# Altium project 1LED+CR12xx_TESTBOARD.PrjPCB
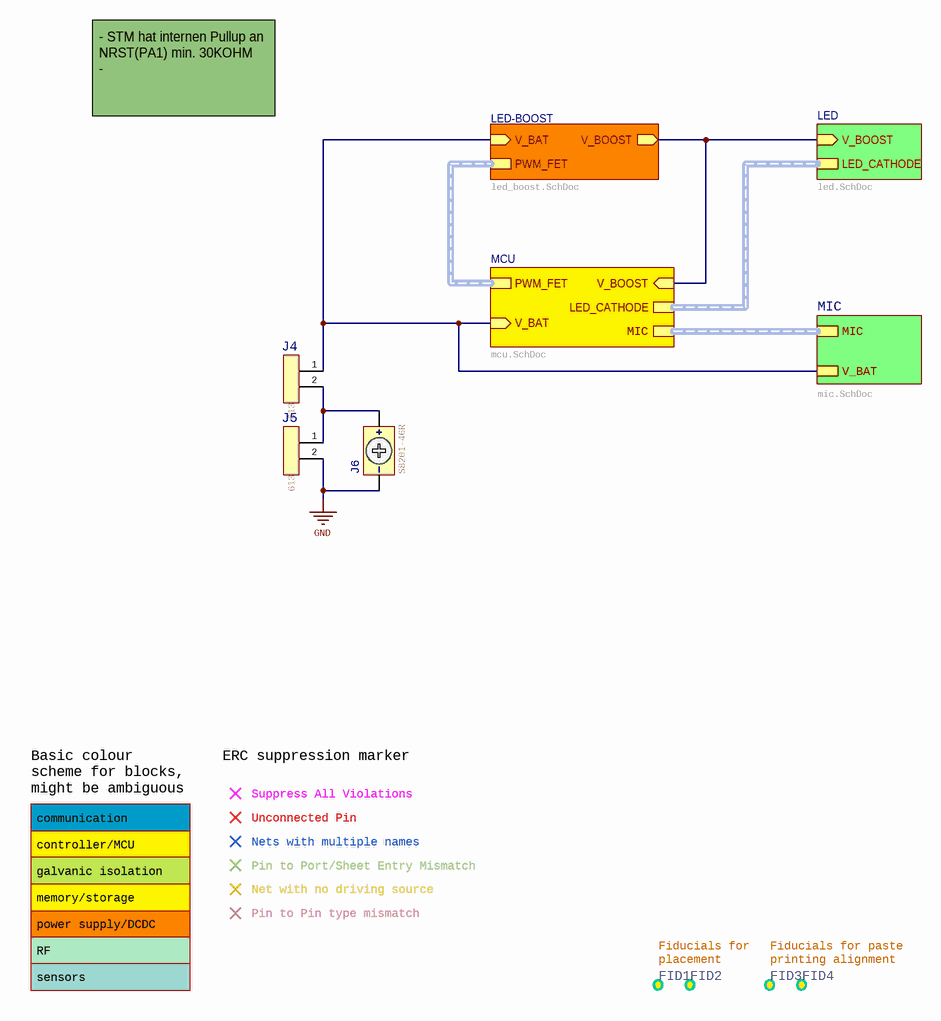
[diagram p0: main.SchDoc]
PCBCopperIL: Set required copper thickness inner layers; PCBCopperOL: Set required copper thickness outer layers; PCBFinish: Set required finished; PCBHoleSize: Set min finished hole size; PCBIsolationIL: Set min isolation IL; PCBIsolationOL: Set min isolation OL; PCBMaterial: FR4; PCBMinIAR: Set min IAR; PCBMinOAR: Set min OAR; PCBNumLayers: Set # of layers; PCBSeparation: Set separation methof (Breakrouting/V-cut); PCBThickness: Set final PCB thickness; PCBTrackWidthIL: Set min track width IL; PCBTrackWidthOL: Set min track width OL; ProjectCustomer: Set ProjectCustomer in Project Options; ProjectPart: Set ProjectPart in Project Options; ProjectTitle: Set ProjectTitle in Project Options
5 sheets, 52 parts. Net scope: hierarchical (ports join the sheet entries above them; power ports are global).
Board files: 1RGB-LED-Board_CR12xx-TESTBOARD.PcbDoc, 1RGB-LED-Board_CR12xx_TestPanel.PcbDoc
Sheets:
  main.SchDoc
    MCU = mcu.SchDoc
    LED = led.SchDoc
    LED-BOOST = led_boost.SchDoc
    MIC = mic.SchDoc

## Sheet main.SchDoc
size 297 x 209 mm; ProjectSection: Set ProjectSection in Document Parameters; PageSetup: Record=PageOptions|CenterHorizontal=True|CenterVertical=True|PrintScale=1.00|XCorrection=1.00|YCorrection=1.00|PrintKind=1|BorderSize=5000000|LeftOffset=0|BottomOffset=0|Orientation=2|PaperLength=1000|PaperWidth=1000|Scale=100|PaperSource=7|PrintQuality=1200|MediaType=1|DitherType=10|PaperKind=A4|PrintScaleMode=1

### Parts
FID1  FIDUCIAL  [FID-1MM-0.5MM]  (value not drawn)  (no BOM)
FID2  FIDUCIAL  [FID-1MM-0.5MM]  (value not drawn)  (no BOM)
FID3  FIDUCIAL-CIRCLE-PASTE  [FID-1MM-0.5MM-PASTE]  (value not drawn)  (no BOM)
FID4  FIDUCIAL-CIRCLE-PASTE  [FID-1MM-0.5MM-PASTE]  (value not drawn)  (no BOM)
J4  Manufacturer P/N: 61300211121  [CON-02-1-254-V-T-PFL-Jumper]  (hidden comment: CON-02)
J5  Manufacturer P/N: 61300211121  [CON-02-1-254-V-T-PFL-Jumper]  (hidden comment: CON-02)
J6  Manufacturer P/N: S8201-46R  [BAT-CR1225-SMD-HARWIN]  (hidden comment: BAT-COIN)

### Sub-sheets
LED = led.SchDoc: V_BOOST (in), LED_CATHODE (harness LED_CATHODE)
LED-BOOST = led_boost.SchDoc: PWM_FET (harness PWM_FET), V_BAT (in), V_BOOST (out)
MCU = mcu.SchDoc: V_BAT (in), LED_CATHODE (harness LED_CATHODE), PWM_FET (harness PWM_FET), V_BOOST (in), MIC (harness MIC)
MIC = mic.SchDoc: MIC (harness MIC), V_BAT

### Nets
GND: J5.2 J6.2(-)
V_BAT: J4.1 ; sheet MCU/V_BAT, sheet LED-BOOST/V_BAT, sheet MIC/V_BAT
V_BOOST: sheet MCU/V_BOOST, sheet LED/V_BOOST, sheet LED-BOOST/V_BOOST
NetJ4_2: J4.2 J5.1 J6.1(+)

### Buses and harness runs
harness sheet LED-BOOST/PWM_FET = sheet MCU/PWM_FET
harness sheet LED/LED_CATHODE = sheet MCU/LED_CATHODE
harness sheet MCU/MIC = sheet MIC/MIC

### Notes on the sheet
- - STM hat internen Pullup an NRST(PA1) min. 30KOHM
  -
- Suppress All Violations
- communication
- controller/MCU
- Unconnected Pin
- Nets with multiple names
- Pin to Port/Sheet Entry Mismatch
- power supply/DCDC
- memory/storage
- galvanic isolation
- Net with no driving source
- Pin to Pin type mismatch
- Basic colour scheme for blocks, might be ambiguous
- RF
- sensors
- ERC suppression marker
- Fiducials for
  placement
- Fiducials for paste
  printing alignment
- PCB production parameters
- # of layers:
- material:
- copper thickness (µm)
- outer layers:
- hole parameters (µm)
- final pcb thickness (mm):
- min finished hole size:
- separation method:
- surface finish:
- min track width outer layers (µm):
- min track width inner layers (µm):
- Project
- inner layers:
- Customer
- min outer annular ring:
- min inner annular ring:
- isolation distance outer layers (µm):
- isolation distance inner layers (µm):
- File Name
- Part
- Section
- Revision (File)
- Variant
- Revision (Project)
- Date
- Sheet
- Contronix GmbH <https://contronix.de>
- Nizzastr. 6, 01445 Radebeul

### Library data of the parts
FID1 FID2 = FID-1MM-0.5MM: Fiducial Mark, 1mm diameter, 0.5mm clearance; hasAltManufacturer: 0; Contronix P/N: W2HGX5; Design Item Id: FID-1MM-0.5MM; Created: 28.03.2011 09:53:08; Modified: 14.03.2013 14:16:18; Obsolete: 0
FID3 FID4 = FID-1MM-0.5MM-CIRCLE-PASTE: Fiducial Mark, 1mm circle0.5mm clearance, Pastemask open; hasAltManufacturer: 0; Contronix P/N: M7DEYG; Design Item Id: FID-1MM-0.5MM-CIRCLE-PASTE; Created: 27.10.2017 07:53:13; Modified: 27.10.2017 07:53:13; Obsolete: 0
J4 J5 = CON-02-1-254-V-T-PFL-Jumper: Stiftleiste, 2-polig, 2.54mm, +Jumper; Manufacturer: Würth Elektronik; hasAltManufacturer: 0; Contronix P/N: JT919C; NumberOfPins: 2; NumberOfRows: 1; Pitch: 2,54; Rev: =VersionControl_RevNumber; Design Item Id: CON-02-1-254-V-T-PFL-Jumper; Manufacturer Part Number: 61300211121; Stock: 0; Price: 0,05; Price (€): 0,05; autIdem: 0; A I: 0; ComponentLink1Description: Manufacturer Datasheet; ComponentLink1URL: http://www.molex.com/datasheets/pdf/0879140216_PCB_HEADERS.pdf; Supplier 1: Digi-Key; Supplier Part Number 1: 732-5315-ND; Supplier 2: Mouser; Supplier Part Number 2: 710-61300211121; Modified: 25.07.2019 11:36:41; Obsolete: 0; MountingType: THT
J6 = BAT-CR1225-SMD-HARWIN: CR1216 1225 Battery Holder SMT; Manufacturer: Harwin; hasAltManufacturer: 0; Contronix P/N: JWVM9H; NumberOfPins: 2; NumberOfRows: 1; Rev: =VersionControl_RevNumber; Design Item Id: BAT-CR1225-SMD-HARWIN; Price: 0,57; Price (€): 0,57; ComponentLink1Description: Manufacturer Drawing; ComponentLink1URL: https://cdn.harwin.com/pdfs/S8201R.pdf; Supplier 1: Digi-Key; Supplier Part Number 1: 952-1662-1-ND; Supplier 2: Mouser; Supplier Part Number 2: 855-S8201-46R; Created: 21.09.2020 18:54:32; Modified: 21.09.2020 18:54:32; Obsolete: 0; Type: Battery Holder; MountingType: SMT; Manufacturer Part Number: S8201-46R

## Sheet mcu.SchDoc
size 292 x 204 mm; ProjectSection: Set ProjectSection in Document Parameters; PageSetup: Record=PageOptions|CenterHorizontal=True|CenterVertical=True|PrintScale=1.00|XCorrection=1.00|YCorrection=1.00|PrintKind=1|BorderSize=5000000|LeftOffset=0|BottomOffset=0|Orientation=2|PaperLength=1000|PaperWidth=1000|Scale=100|PaperSource=7|PrintQuality=1200|MediaType=1|DitherType=10|PaperKind=A4|PrintScaleMode=1
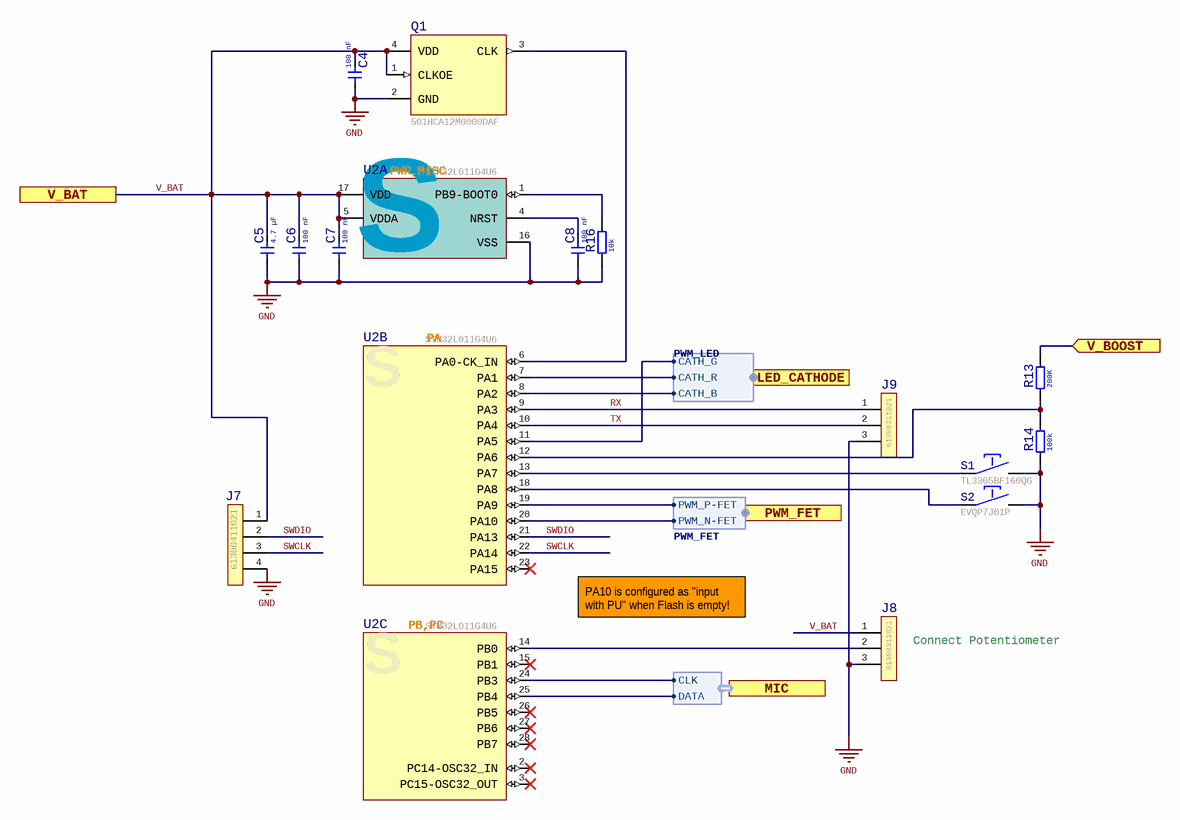
[diagram p1: mcu.SchDoc]

### Parts
C4  value 100 nF  [1608C]  (hidden comment: CAP-NP)
C5  value 4.7 µF  [1608C]  (hidden comment: CAP-NP)
C6  value 100 nF  [1608C]  (hidden comment: CAP-NP)
C7  value 100 nF  [1608C]  (hidden comment: CAP-NP)
C8  value 100 nF  [1608C]  (hidden comment: CAP-NP)
J7  Manufacturer P/N: 61300411021  [CON-04-1-254-H-T-PFL]  (hidden comment: CON-04)
J8  Manufacturer P/N: 61300311021  [CON-03-1-254-H-T-PFL]  (hidden comment: CON-03)
J9  Manufacturer P/N: 61300311021  [CON-03-1-254-H-T-PFL]  (hidden comment: CON-03)
Q1  Manufacturer P/N: 501HCA12M0000DAF  [CRYS-OSC-2.5x2.0]  (hidden comment: CRYS-OSC)
R13  value 200K  [1608R]  (hidden comment: RES)
R14  value 100k  [1608R]  (hidden comment: RES)
R16  value 10k  [1608R]  (hidden comment: RES)
S1  Manufacturer P/N: TL3305BF160QG  [SWI-PU-TL3305BF]  (hidden comment: SWI-PU)
S2  Manufacturer P/N: EVQP7J01P  [SWI-PU-RA-EVQP7(A+J)01P-REVERSEMOUNT]  (hidden comment: SWI-PU)
U2  Manufacturer P/N: STM32L011G4U6  [IC-ST-UFQFN28]  (hidden comment: IC-STM32L011GxUx-QFN28)  (parts A,B,C of 3)

### Ports
LED_CATHODE (harness PWM_LED), MIC (harness MIC), PWM_FET (harness PWM_FET), V_BAT, V_BOOST (in)

### Harnesses
PWM_LED: CATH_R, CATH_B, CATH_G
PWM_FET: PWM_P-FET, PWM_N-FET
MIC: DATA, CLK

### Nets
GND: C4.1 C5.1 C6.1 C7.1 C8.1 J7.4 J8.3 J9.3 Q1.2(GND) R14.1 R16.1 S1.2 S2.2 U2.16(VSS)
RX: J9.1 U2.9(PA3)
SWCLK: J7.3 U2.22(PA14)
SWDIO: J7.2 U2.21(PA13)
TX: J9.2 U2.10(PA4)
V_BAT: C4.2 C5.2 C6.2 C7.2 J7.1 J8.1 Q1.1(CLKOE) Q1.4(VDD) U2.5(VDDA) U2.17(VDD) ; port V_BAT
V_BOOST: R13.2 ; port V_BOOST
NetC8_2: C8.2 U2.4(NRST)
NetJ8_2: J8.2 U2.14(PB0)
NetJP1_1: U2.19(PA9) ; port PWM_FET.PWM_P-FET
NetJP2_1: U2.20(PA10) ; port PWM_FET.PWM_N-FET
NetN1_1: U2.25(PB4) ; port MIC.DATA
NetN1_4: U2.24(PB3) ; port MIC.CLK
NetQ1_3: Q1.3(CLK) U2.6(PA0-CK_IN)
NetR1_2: U2.7(PA1) ; port LED_CATHODE.CATH_R
NetR2_2: U2.11(PA5) ; port LED_CATHODE.CATH_G
NetR3_2: U2.8(PA2) ; port LED_CATHODE.CATH_B
NetR13_1: R13.1 R14.2 U2.12(PA6)
NetR16_2: R16.2 U2.1(PB9-BOOT0)
NetS1_1: S1.1 U2.13(PA7)
NetS2_1: S2.1 U2.18(PA8)

Not connected (* = marked no-connect by the designer): U2 2(PC14-OSC32_IN)* 3(PC15-OSC32_OUT)* 15(PB1)* 23(PA15)* 26(PB5)* 27(PB6)* 28(PB7)*

### Notes on the sheet
- PA10 is configured as "input with PU" when Flash is empty!
- (near J8) Connect Potentiometer
- Project
- Customer
- File Name
- Part
- Section
- Revision (File)
- Variant
- Revision (Project)
- Date
- Sheet
- Contronix GmbH
- Nizzastr. 6, 01445 Radebeul
- (in symbol IC-STM32L011G4U6-QFN28, part A) PWR,MISC; S
- (in symbol IC-STM32L011G4U6-QFN28, part B) PA; S
- (in symbol IC-STM32L011G4U6-QFN28, part C) PB,PC; S

### Library data of the parts
C4 C6-C8 = CAP-100n-16V-10%-X7R-1608: SMD ceramic capacitor; Manufacturer: Samsung; Manufacturer P/N: CL10B104KO8NNNC; hasAltManufacturer: 0; Contronix P/N: C41RLV; autIdem: 255; NozzleType: 701/901; FeederType: Tape 8mm; FeederPitch: 4mm; NumberOfPins: 2; NumberOfRows: 1; Voltage: 16; Tolerance: 10%; PackageCNTX: 1608; CapacitanceSI: 1E-7; Design Item Id: CAP-100n-16V-10%-X7R-1608; Stock: 700; Price: 0,09; Price (€): 0,09; A I: 255; Supplier 1: Digi-Key; Supplier Part Number 1: 1276-1005-1-ND; Modified: 07.07.2020 16:43:22; Obsolete: 0; Voltage (V): 16; PackageManufacturer: 1608; MountingType: SMT; polarized: 0; Manufacturer Part Number: CL10B104KO8NNNC
C5 = CAP-4u7-10V-10%-X5R-1608: SMD ceramic capacitor, X5R; Manufacturer: Samsung; Manufacturer P/N: CL10A475KP8NNNC; hasAltManufacturer: 0; Contronix P/N: CKAU8N; autIdem: 255; NozzleType: 711/911; FeederType: Tape 8mm; FeederPitch: 4mm; NumberOfPins: 2; NumberOfRows: 1; Voltage: 10; Tolerance: 10%; PackageCNTX: 1608; CapacitanceSI: 4,7E-6; Design Item Id: CAP-4u7-10V-10%-X5R-1608; Stock: 455; Price: 0,13; Price (€): 0,13; A I: 255; ComponentLink1Description: Manufacturer Datasheet; ComponentLink1URL: http://www.samsungsem.com/kr/support/product-search/mlcc/__icsFiles/afieldfile/2019/05/10/19-CL10A475KP8NNNC.pdf; Supplier 1: Digi-Key; Supplier Part Number 1: 1276-1044-1-ND; Modified: 26.06.2020 15:47:54; Obsolete: 0; Voltage (V): 10; PackageManufacturer: 1608; Material: X5R; MountingType: SMT; polarized: 0; Manufacturer Part Number: CL10A475KP8NNNC
J7 = CON-04-1-254-H-T-PFL: 2.54 mm THT Stiftleiste einreihig abgewinkelt; Manufacturer: Würth Elektronik; hasAltManufacturer: 0; Contronix P/N: J47NPE; NumberOfPins: 4; NumberOfRows: 1; Pitch: 2,54; Voltage: 250; Current: 3; Design Item Id: CON-04-1-254-H-T-PFL; Manufacturer Part Number: 61300411021; Price: 0,33; Price (€): 0,33; autIdem: 0; A I: 0; ComponentLink1Description: Manufacturer Datasheet; ComponentLink1URL: http://katalog.we-online.de/em/datasheet/6130xx11021.pdf; Supplier 1: Mouser; Supplier Part Number 1: 710-61300411021; Supplier 2: Digi-Key; Supplier Part Number 2: 732-5337-ND; Created: 26.04.2013 16:53:18; Modified: 08.07.2020 13:51:49; Obsolete: 0; MountingType: THT
J8 J9 = CON-03-1-254-H-T-PFL: 2.54 mm THT Stiftleiste einreihig abgewinkelt WR-PHD; Manufacturer: Würth Elektronik; hasAltManufacturer: 0; Contronix P/N: J7DBHL; autIdem: 255; NumberOfPins: 3; NumberOfRows: 1; Pitch: 2,54; Voltage: 250; Design Item Id: CON-03-1-254-H-T-PFL; Manufacturer Part Number: 61300311021; Stock: 10; Price: 0,22; Price (€): 0,22; A I: 255; Supplier 1: Mouser; Supplier Part Number 1: 710-61300311021; Supplier 2: Digi-Key; Supplier Part Number 2: 732-5336-ND; Created: 26.02.2014 16:48:15; Modified: 19.11.2020 16:50:59; Obsolete: 0; MountingType: THT; Current: 3
Q1 = CRYS-OSC-12MHz-SL-2.5x2-50ppm: Crystal Oscillator; Manufacturer: Silicon Laboratories Inc.; hasAltManufacturer: 0; Contronix P/N: QKVPV6; NumberOfPins: 4; NumberOfRows: 2; Frequency: 12 MHz; Value: 12 MHz; Tolerance: 50 ppm; Rev: =VersionControl_RevNumber; Design Item Id: CRYS-OSC-12MHz-SL-2.5x2-50ppm; Manufacturer Part Number: 501HCA12M0000DAF; ComponentLink1Description: Manufacturer Datasheet; ComponentLink1URL: http://www.silabs.com/Support%20Documents/TechnicalDocs/Si501-2-3.pdf; Supplier 1: Digi-Key; Supplier Part Number 1: 336-2890-ND; Supplier 2: Mouser; Supplier Part Number 2: 634-501HCA12M0000DAF; Created: 09.12.2015 13:31:20; Modified: 31.07.2018 12:04:49; Obsolete: 0
R13 = RES-200K-1%-0.1W-1608: SMD resistor; Manufacturer: Bourns Inc.; Manufacturer P/N: CR0603-FX-2003ELF; hasAltManufacturer: 0; Contronix P/N: RU9VK8; NozzleType: 711/911; FeederType: Tape 8mm; FeederPitch: 4mm; PackageCNTX: 1608; NumberOfPins: 2; NumberOfRows: 1; ResistanceSI: 200; Tolerance: 1%; Power: 0,1; Design Item Id: RES-200K-1%-0.1W-1608; Stock: 990; Price: 0,1; Price (€): 0,1; autIdem: 0; A I: 0; Supplier 1: Mouser; Supplier Part Number 1: 652-CR0603FX-2003ELF; Supplier 2: Digi-Key; Supplier Part Number 2: CR0603-FX-2003ELFCT-ND; Created: 25.09.2019 09:10:32; Modified: 08.10.2019 17:16:22; Obsolete: 0; PackageManufacturer: 1608; Resistance: 200K; MountingType: SMT; Manufacturer Part Number: CR0603-FX-2003ELF
R14 = RES-100k-1%-0.1W-1608: SMD resistor; Manufacturer: Panasonic - ECG; Manufacturer P/N: ERJ-2RKF1003X; hasAltManufacturer: 0; Contronix P/N: RBZVDE; autIdem: 255; NozzleType: 711/911; FeederType: Tape 8mm; FeederPitch: 4mm; PackageCNTX: 1608; NumberOfPins: 2; NumberOfRows: 1; ResistanceSI: 100000; Tolerance: 1%; Power: 0,1; Design Item Id: RES-100k-1%-0.1W-1608; Stock: 3994; Price: 0,01; Price (€): 0,01; A I: 255; ComponentLink1Description: Manufacturer Datasheet; ComponentLink1URL: http://www.mouser.com/ds/2/315/AOA0000C86-911473.pdf; Supplier 1: Digi-Key; Supplier Part Number 1: P100KLCT-ND; Supplier 2: Mouser; Supplier Part Number 2: 667-ERJ-2RKF1003X; Modified: 27.07.2018 09:54:07; Obsolete: 0; PackageManufacturer: 1608; Resistance: 100k; MountingType: SMT; Manufacturer Part Number: ERJ-2RKF1003X
R16 = RES-100k-1%-0.1W-1608: SMD resistor; Manufacturer: Panasonic - ECG; Manufacturer P/N: ERJ-2RKF1003X; hasAltManufacturer: 0; Contronix P/N: RBZVDE; autIdem: 255; NozzleType: 711/911; FeederType: Tape 8mm; FeederPitch: 4mm; PackageCNTX: 1608; NumberOfPins: 2; NumberOfRows: 1; Resistance: 100k; ResistanceSI: 100000; Tolerance: 1%; Power: 0,1; Design Item Id: RES-100k-1%-0.1W-1608; Stock: 3994; Price: 0,01; Price (€): 0,01; A I: 255; ComponentLink1Description: Manufacturer Datasheet; ComponentLink1URL: http://www.mouser.com/ds/2/315/AOA0000C86-911473.pdf; Supplier 1: Digi-Key; Supplier Part Number 1: P100KLCT-ND; Supplier 2: Mouser; Supplier Part Number 2: 667-ERJ-2RKF1003X; Modified: 27.07.2018 09:54:07; Obsolete: 0; PackageManufacturer: 1608; MountingType: SMT; Manufacturer Part Number: ERJ-2RKF1003X
S1 = SWI-PU-TL3305BF160QG: SMD Push Button; Manufacturer: E-Switch; hasAltManufacturer: 0; Contronix P/N: SMYVDF; NozzleType: 701/901; FeederType: Tape 16mm; FeederPitch: 8mm; NumberOfPins: 4; NumberOfRows: 2; Design Item Id: SWI-PU-TL3305BF160QG; Manufacturer Part Number: TL3305BF160QG; Stock: 0; Price: 0,28; Price (€): 0,28; ComponentLink1Description: Manufacturer Drawing; ComponentLink1URL: http://spec_sheets.e-switch.com/specs/P010469.pdf; Supplier 1: Mouser; Supplier Part Number 1: 612-TL3305BF160QG; Supplier 2: Digi-Key; Supplier Part Number 2: EG5351CT-ND; Created: 24.06.2019 10:22:36; Modified: 01.07.2020 16:19:31; Obsolete: 0; Type: Pushbutton SPST; MountingType: SMT
S2 = SWI-PU-RA-EVQP7J01P: SMD Push Button, Right Angle, straight terminals; Manufacturer: Panasonic; hasAltManufacturer: 0; Contronix P/N: SGUKDA; NumberOfPins: 4; NumberOfRows: 2; Design Item Id: SWI-PU-RA-EVQP7J01P; Manufacturer Part Number: EVQP7J01P; Stock: 0; Price: 0,28; Price (€): 0,28; Supplier 1: Mouser; Supplier Part Number 1: 667-EVQP7J01P; Supplier 2: Digi-Key; Supplier Part Number 2: P16767CT-ND; Created: 28.03.2018 19:53:29; Modified: 24.11.2020 18:20:58; Obsolete: 0; Type: Pushbutton SPST; MountingType: SMT
U2 = IC-STM32L011G4U6-QFN28: Access line ultra-low-power 32-bit MCU Arm®-based Cortex®-M0+, 16KB Flash, 2KB SRAM, 512B EEPROM, ADC; Manufacturer: ST Microelectronics; hasAltManufacturer: 0; Contronix P/N: U8HUKC; PackageCNTX: QFN-28; NumberOfPins: 28; NumberOfRows: 4; VoltageMin: 1,65; VoltageMax: 3,6; Core: Cortex-M0+; Flash: 16; RAM: 2; EEPROM: 512; I2C: 1; GPIOs: 24; ADCchannels: 10; ADCbits: 12; Rev: =VersionControl_RevNumber; Design Item Id: IC-STM32L011G4U6-QFN28; Manufacturer Part Number: STM32L011G4U6; Price: 1,9; Price (€): 1,9; ComponentLink1Description: Manufacturer Datasheet; ComponentLink1URL: https://www.st.com/resource/en/datasheet/stm32l011g4.pdf; Supplier 1: Digi-Key; Supplier Part Number 1: 497-18803-1-ND; Supplier 2: Farnell; Supplier Part Number 2: 3365502; Created: 19.11.2020 18:45:38; Modified: 19.11.2020 18:48:52; Obsolete: 0; PackageManufacturer: QFN-28; USART: 1; SPI: 1; RTC: 1; MountingType: SMT

## Sheet led.SchDoc
size 292 x 204 mm; ProjectSection: Set ProjectSection in Document Parameters; PageSetup: Record=PageOptions|CenterHorizontal=True|CenterVertical=True|PrintScale=1.00|XCorrection=1.00|YCorrection=1.00|PrintKind=1|BorderSize=5000000|LeftOffset=0|BottomOffset=0|Orientation=2|PaperLength=1000|PaperWidth=1000|Scale=100|PaperSource=7|PrintQuality=1200|MediaType=1|DitherType=10|PaperKind=A4|PrintScaleMode=1
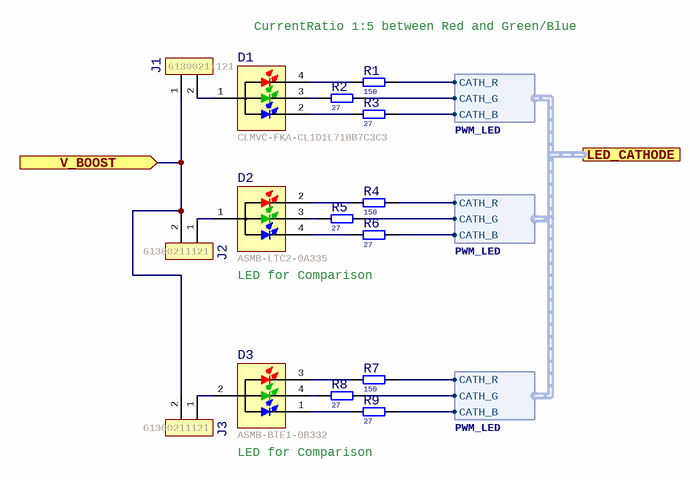
[diagram p2: led.SchDoc]

### Parts
D1  Manufacturer P/N: CLMVC-FKA-CL1D1L71BB7C3C3  [LED-RGB-PLCC4-2020-CLMVx-FKA]  (hidden comment: DIO-LED-RGB-CA-PIN1-CLMVx-FKA)
D2  Manufacturer P/N: ASMB-LTC2-0A335  [LED-RGB-2121-ASMB-LTB]  (hidden comment: DIO-LED-RGB-CA-PIN1)
D3  Manufacturer P/N: ASMB-BTE1-0B332  [LED-RGB-3228-ASMB-BTE]  (hidden comment: DIO-LED-RGB-CA-PIN2-ASMB-BTE1)
J1  Manufacturer P/N: 61300211121  [CON-02-1-254-V-T-PFL-Jumper]  (hidden comment: CON-02)
J2  Manufacturer P/N: 61300211121  [CON-02-1-254-V-T-PFL-Jumper]  (hidden comment: CON-02)
J3  Manufacturer P/N: 61300211121  [CON-02-1-254-V-T-PFL-Jumper]  (hidden comment: CON-02)
R1  value 150  [1608R]  (hidden comment: RES)
R2  value 27  [1608R]  (hidden comment: RES)
R3  value 27  [1608R]  (hidden comment: RES)
R4  value 150  [1608R]  (hidden comment: RES)
R5  value 27  [1608R]  (hidden comment: RES)
R6  value 27  [1608R]  (hidden comment: RES)
R7  value 150  [1608R]  (hidden comment: RES)
R8  value 27  [1608R]  (hidden comment: RES)
R9  value 27  [1608R]  (hidden comment: RES)

### Ports
LED_CATHODE (harness PWM_LED), V_BOOST (in)

### Harnesses
PWM_LED: CATH_R, CATH_B, CATH_G

### Nets
V_BOOST: J1.1 J2.2 J3.2 ; port V_BOOST
NetD1_1: D1.1(Anode) J1.2
NetD1_2: D1.2(B) R3.1
NetD1_3: D1.3(G) R2.1
NetD1_4: D1.4(R) R1.1
NetD2_1: D2.1(Anode) J2.1
NetD2_2: D2.2(R) R4.1
NetD2_3: D2.3(G) R5.1
NetD2_4: D2.4(B) R6.1
NetD3_1: D3.1(B) R9.1
NetD3_2: D3.2(Anode) J3.1
NetD3_3: D3.3(R) R7.1
NetD3_4: D3.4(G) R8.1
NetR1_2: R1.2 R4.2 R7.2 ; port LED_CATHODE.CATH_R
NetR2_2: R2.2 R5.2 R8.2 ; port LED_CATHODE.CATH_G
NetR3_2: R3.2 R6.2 R9.2 ; port LED_CATHODE.CATH_B

### Notes on the sheet
- CurrentRatio 1:5 between Red and Green/Blue
- LED for Comparison
- Project
- Customer
- File Name
- Part
- Section
- Revision (File)
- Variant
- Revision (Project)
- Date
- Sheet
- Contronix GmbH
- Nizzastr. 6, 01445 Radebeul

### Library data of the parts
D1 = LED-RGB-CLMVC-FKA-PLCC4: RGB LED PLCC-4 2x2mm Common Anode; Manufacturer: Cree Inc; hasAltManufacturer: 0; Contronix P/N: DR7TDL; NozzleType: 711/911; FeederType: Tape 8mm; FeederPitch: 4mm; NumberOfPins: 4; NumberOfRows: 2; Design Item Id: LED-RGB-CLMVC-FKA-PLCC4; Stock: 15; Price: 0,17; Price (€): 0,17; ComponentLink1Description: Manufacturer Datasheet; ComponentLink1URL: https://www.cree.com/led-components/media/documents/1273-CLMVC-FKA.pdf; Supplier 1: Digi-Key; Supplier Part Number 1: CLMVC-FKA-CL1D1L71BB7C3C3CT-ND; Supplier 2: Mouser; Supplier Part Number 2: 941-CLMVCFKACL1D1L71; Created: 21.03.2018 20:33:27; Modified: 30.06.2020 13:58:57; Obsolete: 0; Color: RGB; isMulticolor: 0; MountingType: SMT; Manufacturer Part Number: CLMVC-FKA-CL1D1L71BB7C3C3
D2 = LED-RGB-2121-ASMB-LTB: RGB LED Red 621/Green 522/Blue 468, 2.1x2.1mm PLCC-4; Manufacturer: Broadcom Limited; hasAltManufacturer: 0; Remark: Alternative (andere Farbbelegung!): Dialight 598-8710-307F (Digi-Key: 350-2096-1-ND); NumberOfPins: 4; NumberOfRows: 2; PackageCNTX: 2121; Color: Red/Green/Blue; ViewingAngle: 110; isMulticolor: 1; Design Item Id: LED-RGB-2121-ASMB-LTC; Manufacturer Part Number: ASMB-LTC2-0A335; Price: 0,42; Price (€): 0,42; autIdem: 0; A I: 0; ComponentLink1Description: Manufacturer Datasheet; ComponentLink1URL: https://docs.broadcom.com/doc/ASMB-LTB2-0A333-DS; Created: 24.11.2020 08:49:26; Modified: 24.11.2020 11:03:06; Obsolete: 0; PackageManufacturer: 2121; MountingType: SMT
D3 = LED-RGB-3228-ASMB-BTE: RGB LED Red 622/Green 529/Blue 469, 3.2x2.8mm PLCC-4; Manufacturer: Broadcom Limited; hasAltManufacturer: 0; Contronix P/N: DXD6S6; Remark: Alternative (andere Farbbelegung!): Dialight 598-8710-307F (Digi-Key: 350-2096-1-ND); NumberOfPins: 4; NumberOfRows: 2; PackageCNTX: 3228; Color: Red/Green/Blue; isMulticolor: 1; Design Item Id: LED-RGB-3228-ASMB-BTE; Manufacturer Part Number: ASMB-BTE1-0B332; Price: 0,42; Price (€): 0,42; autIdem: 0; A I: 0; ComponentLink1Description: Manufacturer Datasheet; ComponentLink1URL: https://docs.broadcom.com/doc/AV02-4236EN; Supplier 1: Digi-Key; Supplier Part Number 1: 516-3964-1-ND; Supplier 2: Mouser; Supplier Part Number 2: 630-ASMB-BTE1-0B332; Supplier 3: Farnell; Supplier Part Number 3: 2401107; Created: 24.11.2020 17:01:03; Modified: 24.11.2020 17:01:03; Obsolete: 0; PackageManufacturer: 3228; MountingType: SMT
J1-J3 = CON-02-1-254-V-T-PFL-Jumper: as J4 on sheet main; Rev: =VersionControl_RevNumber; Design Item Id: CON-02-1-254-V-T-PFL-Jumper; Manufacturer Part Number: 61300211121; Stock: 43; Price: 0,05; Price (€): 0,05; autIdem: 0; A I: 0; ComponentLink1Description: Manufacturer Datasheet; ComponentLink1URL: http://www.molex.com/datasheets/pdf/0879140216_PCB_HEADERS.pdf; Supplier 1: Digi-Key; Supplier Part Number 1: 732-5315-ND; Supplier 2: Mouser; Supplier Part Number 2: 710-61300211121; Modified: 25.07.2019 11:36:41; Obsolete: 0; MountingType: THT
R1 R4 R7 = RES-150R-1%-0.125W-1608: SMD resistor; Manufacturer: KOA Speer Electronics, Inc.; Manufacturer P/N: RK73H1JTTD1500F; hasAltManufacturer: 0; Contronix P/N: R7WPV7; autIdem: 255; NozzleType: 711/911; FeederType: Tape 8mm; FeederPitch: 4mm; PackageCNTX: 1608; NumberOfPins: 2; NumberOfRows: 1; Tolerance: 1%; Power: 0,125; Design Item Id: RES-150R-1%-0.125W-1608; Manufacturer Part Number: RK73H1JTTD1500F; Stock: 17; Price: 0,08; Price (€): 0,08; A I: 255; Supplier 1: Digi-Key; Supplier Part Number 1: 2019-RK73H1JTTD1500FCT-ND; Supplier 2: Mouser; Supplier Part Number 2: 660-RK73H1JTTD1500F; Created: 17.09.2020 14:11:09; Modified: 17.09.2020 14:14:26; Obsolete: 0; PackageManufacturer: 1608; Resistance: 150; ResistanceSI: 150; MountingType: SMT
R2 R3 R5 R6 R8 R9 = RES-27R-1%-0.1W-1608: SMD resistor; Manufacturer: Stackpole Electronics Inc; Manufacturer P/N: RMCF0603FT27R0; hasAltManufacturer: 0; Contronix P/N: RAE6H8; autIdem: 255; NozzleType: 711/911; FeederType: Tape 8mm; FeederPitch: 4mm; PackageCNTX: 1608; NumberOfPins: 2; NumberOfRows: 1; Tolerance: 1%; Power: 0,1; Design Item Id: RES-27R-1%-0.1W-1608; Manufacturer Part Number: RMCF0603FT27R0; Stock: 3984; Price: 0,003; Price (€): 0,003; A I: 255; ComponentLink1Description: Manufacturer Datasheet; ComponentLink1URL: http://www.seielect.com/Catalog/SEI-RMCF_RMCP.pdf; Supplier 1: Digi-Key; Supplier Part Number 1: RMCF0603FT27R0CT-ND; Created: 23.08.2012 12:04:38; Modified: 23.10.2019 11:35:16; Obsolete: 0; PackageManufacturer: 1608; Resistance: 27; ResistanceSI: 27; MountingType: SMT

## Sheet led_boost.SchDoc
size 292 x 204 mm; ProjectSection: Set ProjectSection in Document Parameters; PageSetup: Record=PageOptions|CenterHorizontal=True|CenterVertical=True|PrintScale=1.00|XCorrection=1.00|YCorrection=1.00|PrintKind=1|BorderSize=5000000|LeftOffset=0|BottomOffset=0|Orientation=2|PaperLength=1000|PaperWidth=1000|Scale=100|PaperSource=7|PrintQuality=1200|MediaType=1|DitherType=10|PaperKind=A4|PrintScaleMode=1
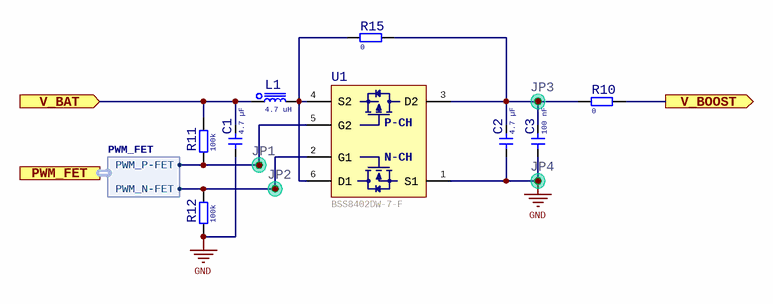
[diagram p3: led_boost.SchDoc]

### Parts
C1  value 4.7 µF  [1608C]  (hidden comment: CAP-NP)
C2  value 4.7 µF  [1608C]  (hidden comment: CAP-NP)
C3  value 100 nF  [1608C]  (hidden comment: CAP-NP)
JP1  CON-01-TESTPOINT  [CON-01-PAD-1.3MM-1MM]  (value not drawn)  (no BOM)
JP2  CON-01-TESTPOINT  [CON-01-PAD-1.3MM-1MM]  (value not drawn)  (no BOM)
JP3  CON-01-TESTPOINT  [CON-01-PAD-1.3MM-1MM]  (value not drawn)  (no BOM)
JP4  CON-01-TESTPOINT  [CON-01-PAD-1.3MM-1MM]  (value not drawn)  (no BOM)
L1  value 4.7 uH  [2012L]  (hidden comment: INDUCTOR)
R10  value 0  [1608R]  (hidden comment: RES)
R11  value 100k  [1608R]  (hidden comment: RES)
R12  value 100k  [1608R]  (hidden comment: RES)
R15  value 0  [1608R]  (hidden comment: RES)
U1  Manufacturer Part Number: BSS8402DW-7-F  [TRANS-DUAL-SOT-363-6]  (hidden comment: TRANS-FET-DUAL-N-P-6PIN)

### Ports
PWM_FET (harness PWM_FET), V_BAT (in), V_BOOST (out)

### Harnesses
PWM_FET: PWM_P-FET, PWM_N-FET

### Nets
GND: C1.1 C2.1 C3.1 JP4.1 R12.1 U1.1(S1)
V_BAT: C1.2 L1.1 R11.2 ; port V_BAT
V_BOOST: R10.2 ; port V_BOOST
NetC2_2: C2.2 C3.2 JP3.1 R10.1 R15.2 U1.3(D2)
NetJP1_1: JP1.1 R11.1 U1.5(G2) ; port PWM_FET.PWM_P-FET
NetJP2_1: JP2.1 R12.2 U1.2(G1) ; port PWM_FET.PWM_N-FET
NetL1_2: L1.2 R15.1 U1.4(S2) U1.6(D1)

### Notes on the sheet
- Project
- Customer
- File Name
- Part
- Section
- Revision (File)
- Variant
- Revision (Project)
- Date
- Sheet
- Contronix GmbH
- Nizzastr. 6, 01445 Radebeul
- (in symbol TRANS-FET-DUAL-N-P-6PIN) P-CH; N-CH

### Library data of the parts
C1 C2 = CAP-4u7-10V-10%-X5R-1608: as C5 on sheet mcu; Design Item Id: CAP-4u7-10V-10%-X5R-1608; Stock: 455; Price: 0,13; Price (€): 0,13; A I: 255; ComponentLink1Description: Manufacturer Datasheet; ComponentLink1URL: http://www.samsungsem.com/kr/support/product-search/mlcc/__icsFiles/afieldfile/2019/05/10/19-CL10A475KP8NNNC.pdf; Supplier 1: Digi-Key; Supplier Part Number 1: 1276-1044-1-ND; Modified: 26.06.2020 15:47:54; Obsolete: 0; Voltage (V): 10; PackageManufacturer: 1608; Material: X5R; MountingType: SMT; polarized: 0; Manufacturer Part Number: CL10A475KP8NNNC
C3 = CAP-100n-16V-10%-X7R-1608: as C4 on sheet mcu; Design Item Id: CAP-100n-16V-10%-X7R-1608; Stock: 700; Price: 0,09; Price (€): 0,09; A I: 255; Supplier 1: Digi-Key; Supplier Part Number 1: 1276-1005-1-ND; Modified: 07.07.2020 16:43:22; Obsolete: 0; Voltage (V): 16; PackageManufacturer: 1608; MountingType: SMT; polarized: 0; Manufacturer Part Number: CL10B104KO8NNNC
JP1-JP4 = CON-01-TESTPOINT-1.3MM-1MM: 1.3 mm rund mit 1.0 mm Bohrung; hasAltManufacturer: 0; Contronix P/N: JMZ13D; NumberOfPins: 1; Design Item Id: CON-01-TESTPOINT-1.3MM-1MM; Price: 0; Price (€): 0; autIdem: 0; A I: 0; Created: 04.06.2015 12:33:39; Modified: 04.06.2015 12:33:39; Obsolete: 0; NumberOfRows: 1; MountingType: THT
L1 = IND-4u7-0.8A-2012: Chip Inductor; Manufacturer: Murata Electronics; Manufacturer P/N: LQM21PN4R7NGRD; hasAltManufacturer: 0; Contronix P/N: LD7UG2; NozzleType: 711/911; FeederType: Tape 8mm; FeederPitch: 4mm; NumberOfPins: 2; NumberOfRows: 1; PackageCNTX: 2012; InductanceSI: 4,7E-6; Current: 0,8; Tolerance: 30%; Resistance: 0.288; Design Item Id: IND-4u7-0.8A-2012; Stock: 18; Price: 0,106; Price (€): 0,106; ComponentLink1Description: Manufacturer Datasheet; ComponentLink1URL: http://search.murata.co.jp/Ceramy/image/img/P02/JELF243B-0026.pdf; Supplier 1: Digi-Key; Supplier Part Number 1: 490-7782-1-ND; Supplier 2: Mouser; Supplier Part Number 2: 81-LQM21PN4R7NGRDRD; Created: 09.11.2017 14:17:36; Modified: 14.11.2018 11:06:53; Obsolete: 0; PackageManufacturer: 2012; Inductance: 4.7 uH; MountingType: SMT; Manufacturer Part Number: LQM21PN4R7NGRD
R10 R15 = RES-0R-1%-0.1W-1608: SMD resistor; Manufacturer: Bourns Inc.; Manufacturer P/N: CR0603-J/-000ELF; Contronix P/N: RBXGUK; autIdem: 255; NozzleType: 701/901; FeederType: Tape 8mm; FeederPitch: 4mm; PackageCNTX: 1608; NumberOfPins: 2; NumberOfRows: 1; Power: 0,1; Design Item Id: RES-0R-1%-0.1W-1608; hasAltManufacturer: 0; Stock: 6271; Price: 0,00373; Price (€): 0,00373; A I: 255; Supplier 1: Mouser; Supplier Part Number 1: 652-CR0603-J/-000ELF; Supplier 2: Digi-Key; Supplier Part Number 2: CR0603-J/-000ELFCT-ND; Modified: 16.08.2019 13:28:22; Obsolete: 0; PackageManufacturer: 1608; Resistance: 0; ResistanceSI: 0; MountingType: SMT; Manufacturer Part Number: CR0603-J/-000ELF
R11 R12 = RES-100k-1%-0.1W-1608: as R14 on sheet mcu; Design Item Id: RES-100k-1%-0.1W-1608; Stock: 3994; Price: 0,01; Price (€): 0,01; A I: 255; ComponentLink1Description: Manufacturer Datasheet; ComponentLink1URL: http://www.mouser.com/ds/2/315/AOA0000C86-911473.pdf; Supplier 1: Digi-Key; Supplier Part Number 1: P100KLCT-ND; Supplier 2: Mouser; Supplier Part Number 2: 667-ERJ-2RKF1003X; Modified: 27.07.2018 09:54:07; Obsolete: 0; PackageManufacturer: 1608; Resistance: 100k; MountingType: SMT; Manufacturer Part Number: ERJ-2RKF1003X
U1 = TRANS-FET-DUAL-N-P-6PIN: N and P-Channel MOSFET; Manufacturer: Diodes Inc.; hasAltManufacturer: 0; FeederType: Tape 8mm; FeederPitch: 4mm; Current: 4,7; Design Item Id: TRANS-FET-DUAL-N-P-20V; ComponentLink1Description: Manufacturer Datasheet; ComponentLink1URL: https://www.diodes.com/assets/Datasheets/DMC2041UFDB.pdf; Created: 13.02.2018 12:07:42

## Sheet mic.SchDoc
size 297 x 209 mm; ProjectSection: Set ProjectSection in Document Parameters; PageSetup: Record=PageOptions|CenterHorizontal=True|CenterVertical=True|PrintScale=1.00|XCorrection=1.00|YCorrection=1.00|PrintKind=1|BorderSize=5000000|LeftOffset=0|BottomOffset=0|Orientation=2|PaperLength=1000|PaperWidth=1000|Scale=100|PaperSource=7|PrintQuality=1200|MediaType=1|DitherType=10|PaperKind=A4|PrintScaleMode=1
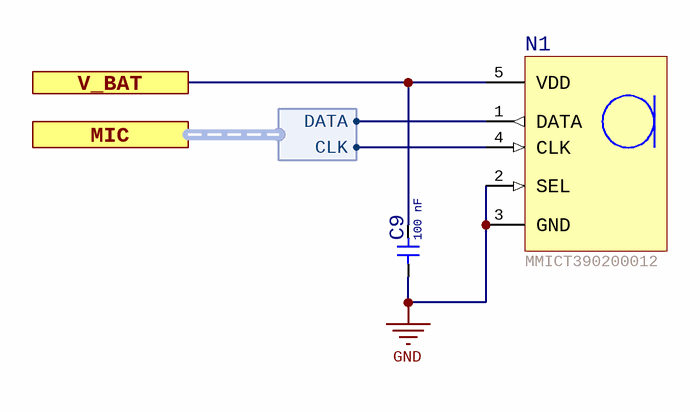
[diagram p4: mic.SchDoc]

### Parts
C9  value 100 nF  [1608C]  (hidden comment: CAP-NP)
N1  Manufacturer P/N: MMICT390200012  [SNS-MIC-T3902]  (hidden comment: SNS-MIC-T3902)

### Ports
MIC (harness MIC), V_BAT

### Harnesses
MIC: DATA, CLK

### Nets
GND: C9.1 N1.2(SEL) N1.3(GND)
V_BAT: C9.2 N1.5(VDD) ; port V_BAT
NetN1_1: N1.1(DATA) ; port MIC.DATA
NetN1_4: N1.4(CLK) ; port MIC.CLK

### Notes on the sheet
- Project
- Customer
- File Name
- Part
- Section
- Revision (File)
- Variant
- Revision (Project)
- Date
- Sheet
- Contronix GmbH <https://contronix.de>
- Nizzastr. 6, 01445 Radebeul

### Library data of the parts
C9 = CAP-100n-16V-10%-X7R-1608: as C4 on sheet mcu; Design Item Id: CAP-100n-16V-10%-X7R-1608; Stock: 700; Price: 0,09; Price (€): 0,09; A I: 255; Supplier 1: Digi-Key; Supplier Part Number 1: 1276-1005-1-ND; Modified: 07.07.2020 16:43:22; Obsolete: 0; Voltage (V): 16; PackageManufacturer: 1608; MountingType: SMT; polarized: 0; Manufacturer Part Number: CL10B104KO8NNNC
N1 = N36NTX: Bottom Port PDM Low‐Power Multi‐Mode Microphone With High AOP Mode; Manufacturer: InvenSense; hasAltManufacturer: 0; Contronix P/N: N36NTX; NumberOfPins: 5; NumberOfRows: 2; VoltageMin: 1,65; VoltageMax: 3,6; PhysicalProperty: Sound; Rev: =VersionControl_RevNumber; Design Item Id: SNS-MIC-T3902; Manufacturer Part Number: MMICT390200012; Price: 0,85; Price (€): 0,85; ComponentLink1Description: Manufacturer Datasheet; ComponentLink1URL: http://invensense.tdk.com/wp-content/uploads/2020/05/DS-000357-T3902-v1.0.pdf; Supplier 1: Digi-Key; Supplier Part Number 1: 1428-MMICT390200012CT-ND; Created: 08.10.2020 15:24:47; Modified: 08.10.2020 16:48:36; Obsolete: 0; MountingType: SMT

## Nets that join several sheets
GND: main (J5.2 J6.2), mcu (14 pins), led_boost (6 pins), mic (C9.1 N1.2 N1.3)
NetJP1_1: mcu (U2.19), led_boost (JP1.1 R11.1 U1.5)
NetJP2_1: mcu (U2.20), led_boost (JP2.1 R12.2 U1.2)
NetN1_1: mcu (U2.25), mic (N1.1)
NetN1_4: mcu (U2.24), mic (N1.4)
NetR1_2: mcu (U2.7), led (R1.2 R4.2 R7.2)
NetR2_2: mcu (U2.11), led (R2.2 R5.2 R8.2)
NetR3_2: mcu (U2.8), led (R3.2 R6.2 R9.2)
V_BAT: main (J4.1), mcu (10 pins), led_boost (C1.2 L1.1 R11.2), mic (C9.2 N1.5)
V_BOOST: mcu (R13.2), led (J1.1 J2.2 J3.2), led_boost (R10.2)